# Altium project radxa_cm5_io_board_v2200_SCH-1.PrjPcb (part 4 of 5)

## Sheet 17_Connector.SchDoc
size 513 x 386 mm
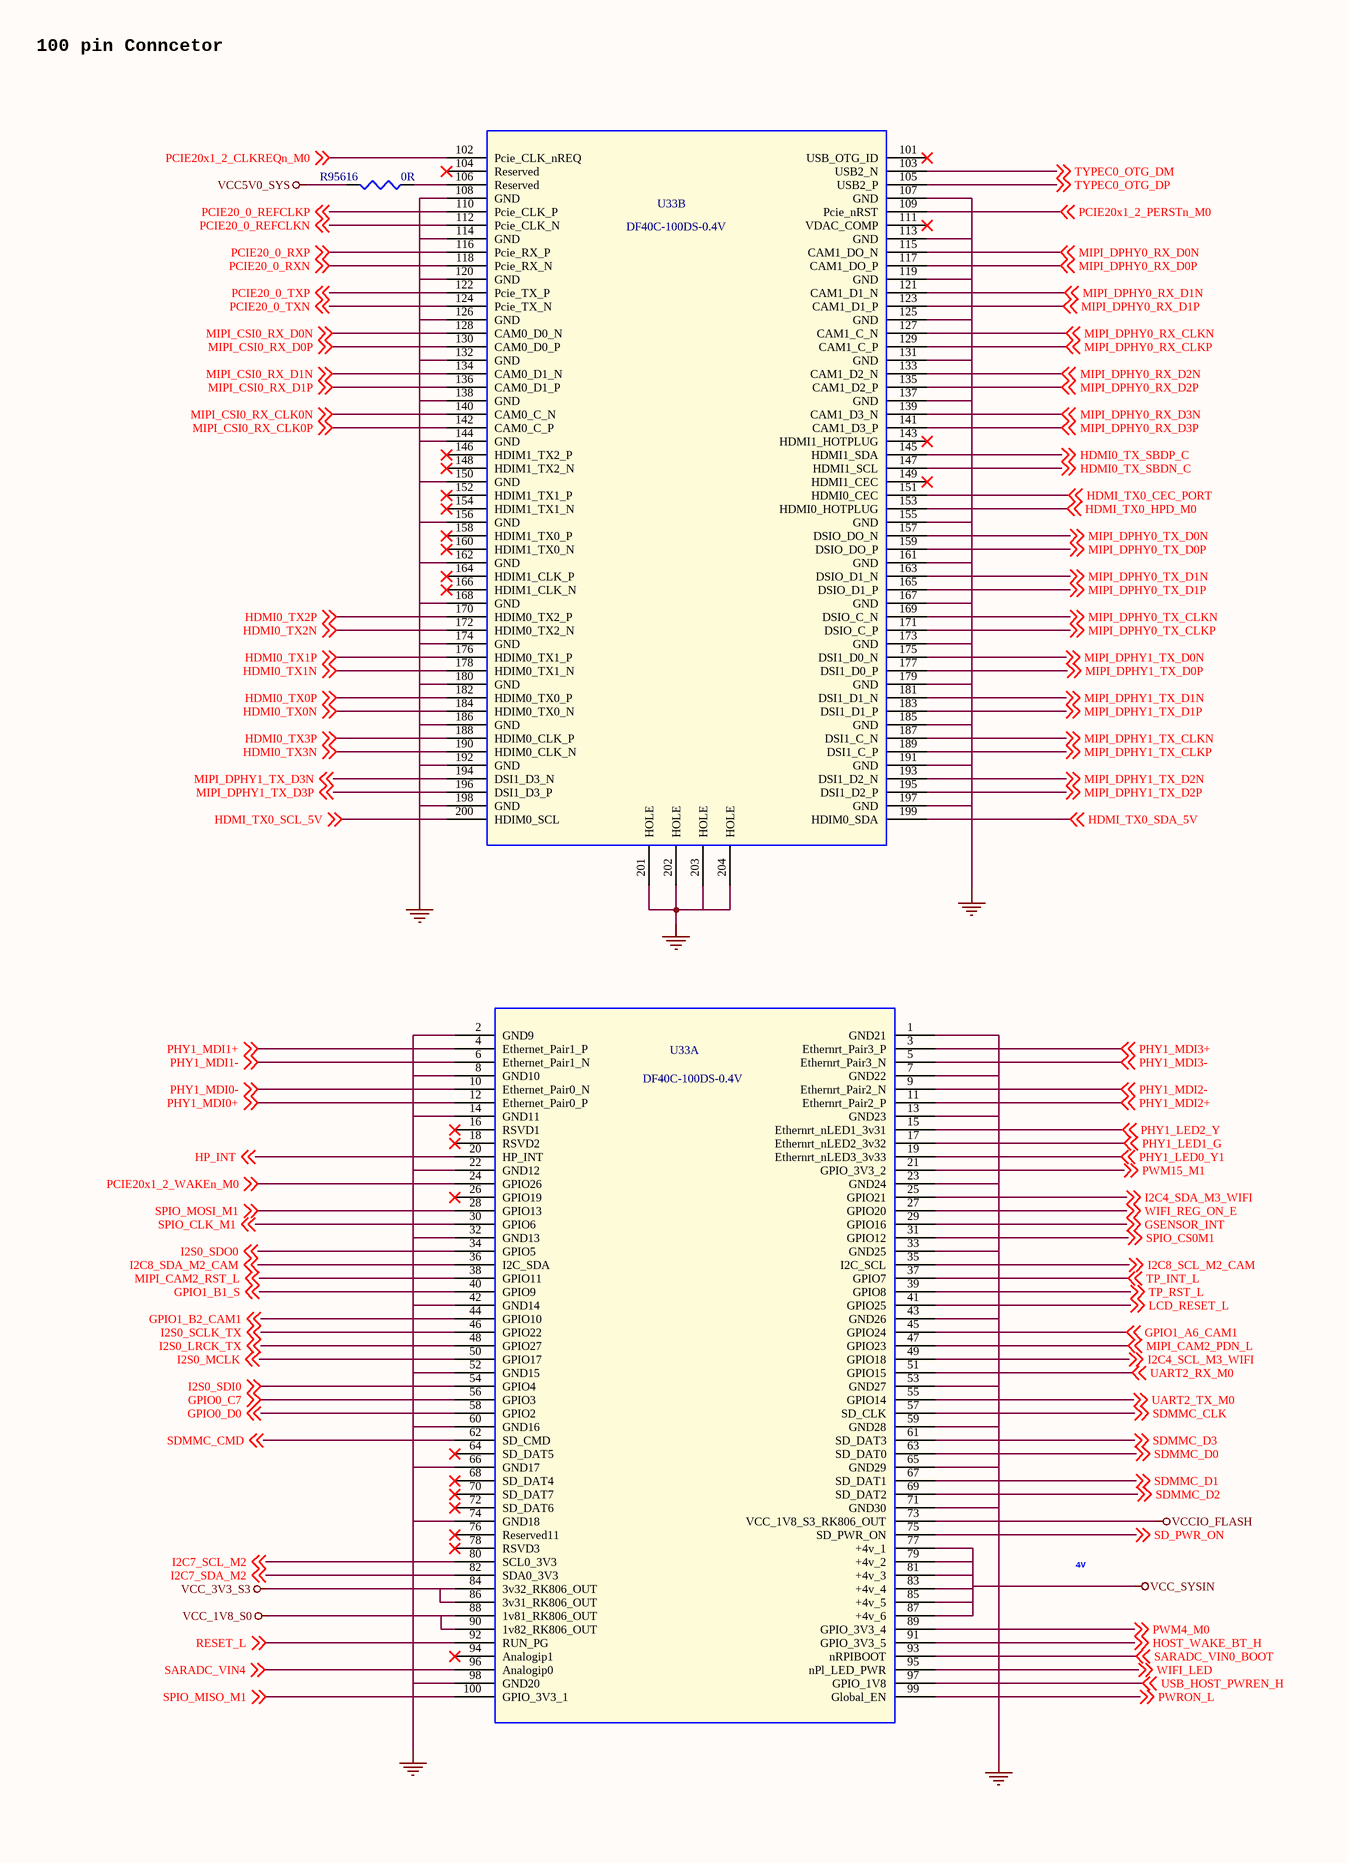
[diagram p16: 17_Connector.SchDoc, left]
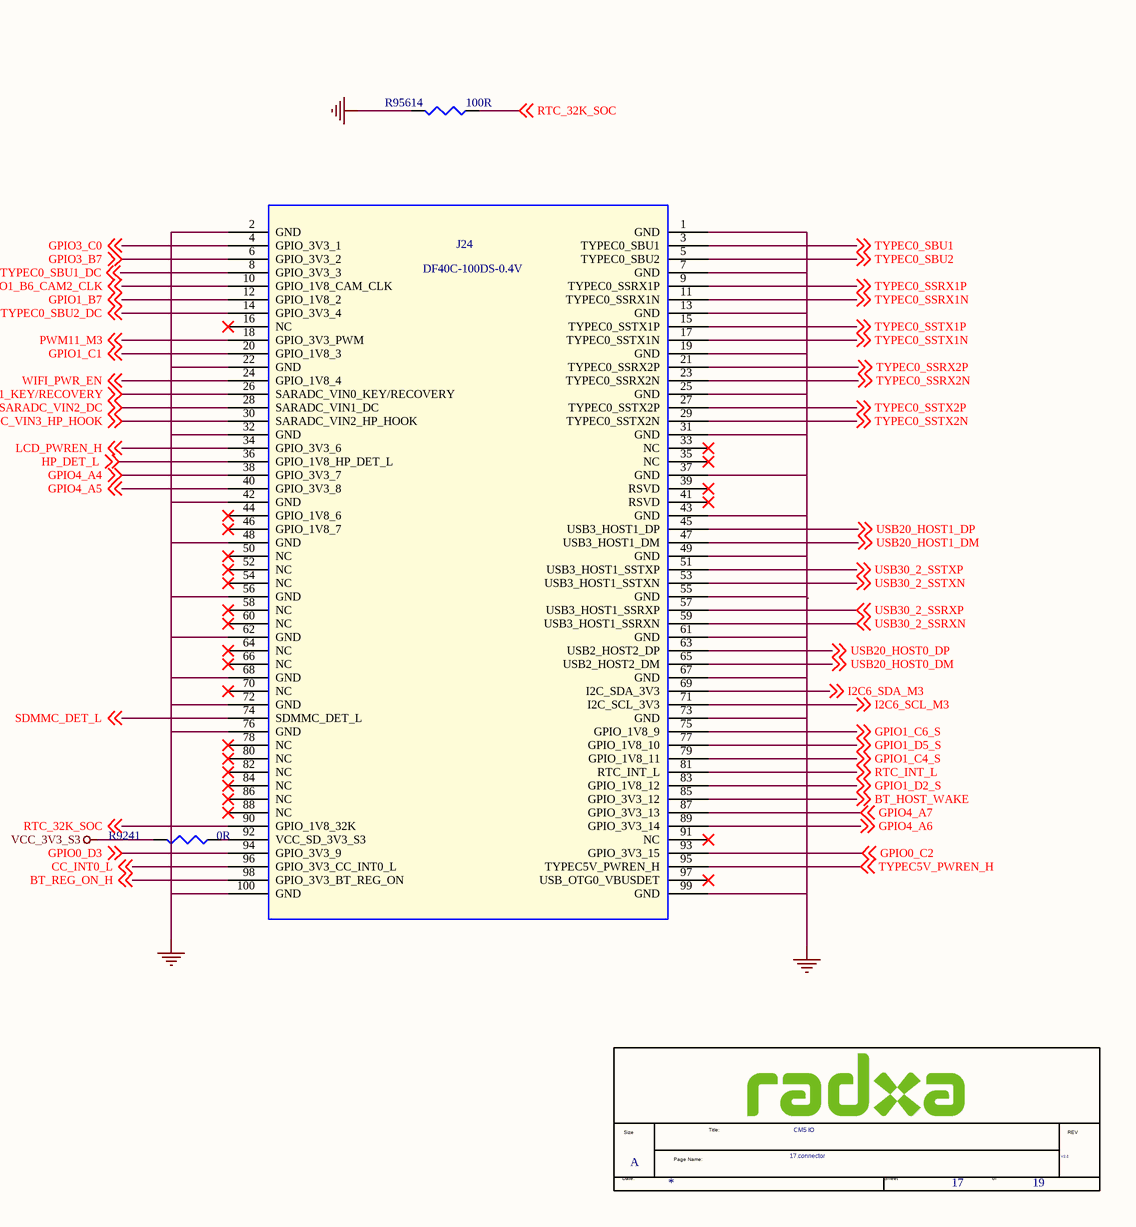
[diagram p17: 17_Connector.SchDoc, right]

### Parts
(Parts that share a designator on the sheet are numbered #1, #2 ... from top to bottom, then left to right.)
*#17  Doc: 17.connector  RevCode: V2.2  Title: CM5 IO  Page Size: A  Page Number: 17  Page Count: 19  (hidden comment: radxa_1010)  (graphical)
J24  DF40C-100DS-0.4V  [DF40C_100DS]
R9241  0R  [R0402]
R95614  100R  [R0402]
R95616  0R  [R0402]
U33#1  DF40C-100DS-0.4V  [DF40C-200DS-D4-OK]  (part B of 2)
U33#2  DF40C-100DS-0.4V  [DF40C-200DS-D4-OK]  (part A of 2)

### Nets
GND: J24.1(GND) J24.2(GND) J24.7(GND) J24.13(GND) J24.19(GND) J24.22(GND) J24.25(GND) J24.31(GND) J24.32(GND) J24.37(GND) J24.42(GND) J24.43(GND) J24.48(GND) J24.49(GND) J24.55(GND) J24.56(GND) J24.61(GND) J24.62(GND) J24.67(GND) J24.68(GND) J24.72(GND) J24.73(GND) J24.76(GND) J24.99(GND) J24.100(GND) R95614.2 U33#1.107(GND) U33#1.108(GND) U33#1.113(GND) U33#1.114(GND) U33#1.119(GND) U33#1.120(GND) U33#1.125(GND) U33#1.126(GND) U33#1.131(GND) U33#1.132(GND) U33#1.137(GND) U33#1.138(GND) U33#1.144(GND) U33#1.150(GND) U33#1.155(GND) U33#1.156(GND) U33#1.161(GND) U33#1.162(GND) U33#1.167(GND) U33#1.168(GND) U33#1.173(GND) U33#1.174(GND) U33#1.179(GND) U33#1.180(GND) U33#1.185(GND) U33#1.186(GND) U33#1.191(GND) U33#1.192(GND) U33#1.197(GND) U33#1.198(GND) U33#1.201(HOLE) U33#1.202(HOLE) U33#1.203(HOLE) U33#1.204(HOLE) U33#2.1(GND21) U33#2.2(GND9) U33#2.7(GND22) U33#2.8(GND10) U33#2.13(GND23) U33#2.14(GND11) U33#2.22(GND12) U33#2.23(GND24) U33#2.32(GND13) U33#2.33(GND25) U33#2.42(GND14) U33#2.43(GND26) U33#2.52(GND15) U33#2.53(GND27) U33#2.59(GND28) U33#2.60(GND16) U33#2.65(GND29) U33#2.66(GND17) U33#2.71(GND30) U33#2.74(GND18) U33#2.98(GND20)
VCC5V0_SYS: R95616.2
VCC_1V8_S0: U33#2.88(1v81_RK806_OUT) U33#2.90(1v82_RK806_OUT)
VCC_3V3_S3: R9241.1 U33#2.84(3v32_RK806_OUT) U33#2.86(3v31_RK806_OUT)
VCC_SYSIN: U33#2.77(+4v_1) U33#2.79(+4v_2) U33#2.81(+4v_3) U33#2.83(+4v_4) U33#2.85(+4v_5) U33#2.87(+4v_6)
VCCIO_FLASH: U33#2.73(VCC_1V8_S3_RK806_OUT)
BT_HOST_WAKE: J24.85(GPIO_3V3_12) ; off-sheet BT_HOST_WAKE
BT_REG_ON_H: J24.98(GPIO_3V3_BT_REG_ON) ; off-sheet BT_REG_ON_H
CC_INT0_L: J24.96(GPIO_3V3_CC_INT0_L) ; off-sheet CC_INT0_L
GPIO0_C2: J24.93(GPIO_3V3_15) ; off-sheet GPIO0_C2
GPIO0_C7: U33#2.56(GPIO3) ; off-sheet GPIO0_C7
GPIO0_D0: U33#2.58(GPIO2) ; off-sheet GPIO0_D0
GPIO0_D3: J24.94(GPIO_3V3_9) ; off-sheet GPIO0_D3
GPIO1_A6_CAM1: U33#2.45(GPIO24) ; off-sheet GPIO1_A6_CAM1
GPIO1_B1_S: U33#2.40(GPIO9) ; off-sheet GPIO1_B1_S
GPIO1_B2_CAM1: U33#2.44(GPIO10) ; off-sheet GPIO1_B2_CAM1
GPIO1_B6_CAM2_CLK: J24.10(GPIO_1V8_CAM_CLK) ; off-sheet GPIO1_B6_CAM2_CLK
GPIO1_B7: J24.12(GPIO_1V8_2) ; off-sheet GPIO1_B7
GPIO1_C1: J24.20(GPIO_1V8_3) ; off-sheet GPIO1_C1
GPIO1_C4_S: J24.79(GPIO_1V8_11) ; off-sheet GPIO1_C4_S
GPIO1_C6_S: J24.75(GPIO_1V8_9) ; off-sheet GPIO1_C6_S
GPIO1_D2_S: J24.83(GPIO_1V8_12) ; off-sheet GPIO1_D2_S
GPIO1_D5_S: J24.77(GPIO_1V8_10) ; off-sheet GPIO1_D5_S
GPIO3_B7: J24.6(GPIO_3V3_2) ; off-sheet GPIO3_B7
GPIO3_C0: J24.4(GPIO_3V3_1) ; off-sheet GPIO3_C0
GPIO4_A4: J24.38(GPIO_3V3_7) ; off-sheet GPIO4_A4
GPIO4_A5: J24.40(GPIO_3V3_8) ; off-sheet GPIO4_A5
GPIO4_A6: J24.89(GPIO_3V3_14) ; off-sheet GPIO4_A6
GPIO4_A7: J24.87(GPIO_3V3_13) ; off-sheet GPIO4_A7
GSENSOR_INT: U33#2.29(GPIO16) ; off-sheet GSENSOR_INT
HDMI0_TX0N: U33#1.184(HDIM0_TX0_N) ; off-sheet HDMI0_TX0N
HDMI0_TX0P: U33#1.182(HDIM0_TX0_P) ; off-sheet HDMI0_TX0P
HDMI0_TX1N: U33#1.178(HDIM0_TX1_N) ; off-sheet HDMI0_TX1N
HDMI0_TX1P: U33#1.176(HDIM0_TX1_P) ; off-sheet HDMI0_TX1P
HDMI0_TX2N: U33#1.172(HDIM0_TX2_N) ; off-sheet HDMI0_TX2N
HDMI0_TX2P: U33#1.170(HDIM0_TX2_P) ; off-sheet HDMI0_TX2P
HDMI0_TX3N: U33#1.190(HDIM0_CLK_N) ; off-sheet HDMI0_TX3N
HDMI0_TX3P: U33#1.188(HDIM0_CLK_P) ; off-sheet HDMI0_TX3P
HDMI0_TX_SBDN_C: U33#1.147(HDMI1_SCL) ; off-sheet HDMI0_TX_SBDN_C
HDMI0_TX_SBDP_C: U33#1.145(HDMI1_SDA) ; off-sheet HDMI0_TX_SBDP_C
HDMI_TX0_CEC_PORT: U33#1.151(HDMI0_CEC) ; off-sheet HDMI_TX0_CEC_PORT
HDMI_TX0_HPD_M0: U33#1.153(HDMI0_HOTPLUG) ; off-sheet HDMI_TX0_HPD_M0
HDMI_TX0_SCL_5V: U33#1.200(HDIM0_SCL) ; off-sheet HDMI_TX0_SCL_5V
HDMI_TX0_SDA_5V: U33#1.199(HDIM0_SDA) ; off-sheet HDMI_TX0_SDA_5V
HOST_WAKE_BT_H: U33#2.91(GPIO_3V3_5) ; off-sheet HOST_WAKE_BT_H
HP_DET_L: J24.36(GPIO_1V8_HP_DET_L) ; off-sheet HP_DET_L
HP_INT: U33#2.20(HP_INT) ; off-sheet HP_INT
I2C4_SCL_M3_WIFI: U33#2.49(GPIO18) ; off-sheet I2C4_SCL_M3_WIFI
I2C4_SDA_M3_WIFI: U33#2.25(GPIO21) ; off-sheet I2C4_SDA_M3_WIFI
I2C6_SCL_M3: J24.71(I2C_SCL_3V3) ; off-sheet I2C6_SCL_M3
I2C6_SDA_M3: J24.69(I2C_SDA_3V3) ; off-sheet I2C6_SDA_M3
I2C7_SCL_M2: U33#2.80(SCL0_3V3) ; off-sheet I2C7_SCL_M2
I2C7_SDA_M2: U33#2.82(SDA0_3V3) ; off-sheet I2C7_SDA_M2
I2C8_SCL_M2_CAM: U33#2.35(I2C_SCL) ; off-sheet I2C8_SCL_M2_CAM
I2C8_SDA_M2_CAM: U33#2.36(I2C_SDA) ; off-sheet I2C8_SDA_M2_CAM
I2S0_LRCK_TX: U33#2.48(GPIO27) ; off-sheet I2S0_LRCK_TX
I2S0_MCLK: U33#2.50(GPIO17) ; off-sheet I2S0_MCLK
I2S0_SCLK_TX: U33#2.46(GPIO22) ; off-sheet I2S0_SCLK_TX
I2S0_SDI0: U33#2.54(GPIO4) ; off-sheet I2S0_SDI0
I2S0_SDO0: U33#2.34(GPIO5) ; off-sheet I2S0_SDO0
LCD_PWREN_H: J24.34(GPIO_3V3_6) ; off-sheet LCD_PWREN_H
LCD_RESET_L: U33#2.41(GPIO25) ; off-sheet LCD_RESET_L
MIPI_CAM2_PDN_L: U33#2.47(GPIO23) ; off-sheet MIPI_CAM2_PDN_L
MIPI_CAM2_RST_L: U33#2.38(GPIO11) ; off-sheet MIPI_CAM2_RST_L
MIPI_CSI0_RX_CLK0N: U33#1.140(CAM0_C_N) ; off-sheet MIPI_CSI0_RX_CLK0N
MIPI_CSI0_RX_CLK0P: U33#1.142(CAM0_C_P) ; off-sheet MIPI_CSI0_RX_CLK0P
MIPI_CSI0_RX_D0N: U33#1.128(CAM0_D0_N) ; off-sheet MIPI_CSI0_RX_D0N
MIPI_CSI0_RX_D0P: U33#1.130(CAM0_D0_P) ; off-sheet MIPI_CSI0_RX_D0P
MIPI_CSI0_RX_D1N: U33#1.134(CAM0_D1_N) ; off-sheet MIPI_CSI0_RX_D1N
MIPI_CSI0_RX_D1P: U33#1.136(CAM0_D1_P) ; off-sheet MIPI_CSI0_RX_D1P
MIPI_DPHY0_RX_CLKN: U33#1.127(CAM1_C_N) ; off-sheet MIPI_DPHY0_RX_CLKN
MIPI_DPHY0_RX_CLKP: U33#1.129(CAM1_C_P) ; off-sheet MIPI_DPHY0_RX_CLKP
MIPI_DPHY0_RX_D0N: U33#1.115(CAM1_DO_N) ; off-sheet MIPI_DPHY0_RX_D0N
MIPI_DPHY0_RX_D0P: U33#1.117(CAM1_DO_P) ; off-sheet MIPI_DPHY0_RX_D0P
MIPI_DPHY0_RX_D1N: U33#1.121(CAM1_D1_N) ; off-sheet MIPI_DPHY0_RX_D1N
MIPI_DPHY0_RX_D1P: U33#1.123(CAM1_D1_P) ; off-sheet MIPI_DPHY0_RX_D1P
MIPI_DPHY0_RX_D2N: U33#1.133(CAM1_D2_N) ; off-sheet MIPI_DPHY0_RX_D2N
MIPI_DPHY0_RX_D2P: U33#1.135(CAM1_D2_P) ; off-sheet MIPI_DPHY0_RX_D2P
MIPI_DPHY0_RX_D3N: U33#1.139(CAM1_D3_N) ; off-sheet MIPI_DPHY0_RX_D3N
MIPI_DPHY0_RX_D3P: U33#1.141(CAM1_D3_P) ; off-sheet MIPI_DPHY0_RX_D3P
MIPI_DPHY0_TX_CLKN: U33#1.169(DSIO_C_N) ; off-sheet MIPI_DPHY0_TX_CLKN
MIPI_DPHY0_TX_CLKP: U33#1.171(DSIO_C_P) ; off-sheet MIPI_DPHY0_TX_CLKP
MIPI_DPHY0_TX_D0N: U33#1.157(DSIO_DO_N) ; off-sheet MIPI_DPHY0_TX_D0N
MIPI_DPHY0_TX_D0P: U33#1.159(DSIO_DO_P) ; off-sheet MIPI_DPHY0_TX_D0P
MIPI_DPHY0_TX_D1N: U33#1.163(DSIO_D1_N) ; off-sheet MIPI_DPHY0_TX_D1N
MIPI_DPHY0_TX_D1P: U33#1.165(DSIO_D1_P) ; off-sheet MIPI_DPHY0_TX_D1P
MIPI_DPHY1_TX_CLKN: U33#1.187(DSI1_C_N) ; off-sheet MIPI_DPHY1_TX_CLKN
MIPI_DPHY1_TX_CLKP: U33#1.189(DSI1_C_P) ; off-sheet MIPI_DPHY1_TX_CLKP
MIPI_DPHY1_TX_D0N: U33#1.175(DSI1_D0_N) ; off-sheet MIPI_DPHY1_TX_D0N
MIPI_DPHY1_TX_D0P: U33#1.177(DSI1_D0_P) ; off-sheet MIPI_DPHY1_TX_D0P
MIPI_DPHY1_TX_D1N: U33#1.181(DSI1_D1_N) ; off-sheet MIPI_DPHY1_TX_D1N
MIPI_DPHY1_TX_D1P: U33#1.183(DSI1_D1_P) ; off-sheet MIPI_DPHY1_TX_D1P
MIPI_DPHY1_TX_D2N: U33#1.193(DSI1_D2_N) ; off-sheet MIPI_DPHY1_TX_D2N
MIPI_DPHY1_TX_D2P: U33#1.195(DSI1_D2_P) ; off-sheet MIPI_DPHY1_TX_D2P
MIPI_DPHY1_TX_D3N: U33#1.194(DSI1_D3_N) ; off-sheet MIPI_DPHY1_TX_D3N
MIPI_DPHY1_TX_D3P: U33#1.196(DSI1_D3_P) ; off-sheet MIPI_DPHY1_TX_D3P
PCIE20_0_REFCLKN: U33#1.112(Pcie_CLK_N) ; off-sheet PCIE20_0_REFCLKN
PCIE20_0_REFCLKP: U33#1.110(Pcie_CLK_P) ; off-sheet PCIE20_0_REFCLKP
PCIE20_0_RXN: U33#1.118(Pcie_RX_N) ; off-sheet PCIE20_0_RXN
PCIE20_0_RXP: U33#1.116(Pcie_RX_P) ; off-sheet PCIE20_0_RXP
PCIE20_0_TXN: U33#1.124(Pcie_TX_N) ; off-sheet PCIE20_0_TXN
PCIE20_0_TXP: U33#1.122(Pcie_TX_P) ; off-sheet PCIE20_0_TXP
PCIE20x1_2_CLKREQn_M0: U33#1.102(Pcie_CLK_nREQ) ; off-sheet PCIE20x1_2_CLKREQn_M0
PCIE20x1_2_PERSTn_M0: U33#1.109(Pcie_nRST) ; off-sheet PCIE20x1_2_PERSTn_M0
PCIE20x1_2_WAKEn_M0: U33#2.24(GPIO26) ; off-sheet PCIE20x1_2_WAKEn_M0
PHY1_LED0_Y1: U33#2.19(Ethernrt_nLED3_3v33) ; off-sheet PHY1_LED0_Y1
PHY1_LED1_G: U33#2.17(Ethernrt_nLED2_3v32) ; off-sheet PHY1_LED1_G
PHY1_LED2_Y: U33#2.15(Ethernrt_nLED1_3v31) ; off-sheet PHY1_LED2_Y
PHY1_MDI0+: U33#2.12(Ethernet_Pair0_P) ; off-sheet PHY1_MDI0+
PHY1_MDI0-: U33#2.10(Ethernet_Pair0_N) ; off-sheet PHY1_MDI0-
PHY1_MDI1+: U33#2.4(Ethernet_Pair1_P) ; off-sheet PHY1_MDI1+
PHY1_MDI1-: U33#2.6(Ethernet_Pair1_N) ; off-sheet PHY1_MDI1-
PHY1_MDI2+: U33#2.11(Ethernrt_Pair2_P) ; off-sheet PHY1_MDI2+
PHY1_MDI2-: U33#2.9(Ethernrt_Pair2_N) ; off-sheet PHY1_MDI2-
PHY1_MDI3+: U33#2.3(Ethernrt_Pair3_P) ; off-sheet PHY1_MDI3+
PHY1_MDI3-: U33#2.5(Ethernrt_Pair3_N) ; off-sheet PHY1_MDI3-
PWM4_M0: U33#2.89(GPIO_3V3_4) ; off-sheet PWM4_M0
PWM11_M3: J24.18(GPIO_3V3_PWM) ; off-sheet PWM11_M3
PWM15_M1: U33#2.21(GPIO_3V3_2) ; off-sheet PWM15_M1
PWRON_L: U33#2.99(Global_EN) ; off-sheet PWRON_L
RESET_L: U33#2.92(RUN_PG) ; off-sheet RESET_L
RTC_32K_SOC: J24.90(GPIO_1V8_32K) R95614.1 ; off-sheet RTC_32K_SOC
RTC_INT_L: J24.81(RTC_INT_L) ; off-sheet RTC_INT_L
SARADC_VIN0_BOOT: U33#2.93(nRPIBOOT) ; off-sheet SARADC_VIN0_BOOT
SARADC_VIN1_KEY/RECOVERY: J24.26(SARADC_VIN0_KEY/RECOVERY) ; off-sheet SARADC_VIN1_KEY/RECOVERY
SARADC_VIN2_DC: J24.28(SARADC_VIN1_DC) ; off-sheet SARADC_VIN2_DC
SARADC_VIN3_HP_HOOK: J24.30(SARADC_VIN2_HP_HOOK) ; off-sheet SARADC_VIN3_HP_HOOK
SARADC_VIN4: U33#2.96(Analogip0) ; off-sheet SARADC_VIN4
SD_PWR_ON: U33#2.75(SD_PWR_ON) ; off-sheet SD_PWR_ON
SDMMC_CLK: U33#2.57(SD_CLK) ; off-sheet SDMMC_CLK
SDMMC_CMD: U33#2.62(SD_CMD) ; off-sheet SDMMC_CMD
SDMMC_D0: U33#2.63(SD_DAT0) ; off-sheet SDMMC_D0
SDMMC_D1: U33#2.67(SD_DAT1) ; off-sheet SDMMC_D1
SDMMC_D2: U33#2.69(SD_DAT2) ; off-sheet SDMMC_D2
SDMMC_D3: U33#2.61(SD_DAT3) ; off-sheet SDMMC_D3
SDMMC_DET_L: J24.74(SDMMC_DET_L) ; off-sheet SDMMC_DET_L
SPIO_CLK_M1: U33#2.30(GPIO6) ; off-sheet SPIO_CLK_M1
SPIO_CS0M1: U33#2.31(GPIO12) ; off-sheet SPIO_CS0M1
SPIO_MISO_M1: U33#2.100(GPIO_3V3_1) ; off-sheet SPIO_MISO_M1
SPIO_MOSI_M1: U33#2.28(GPIO13) ; off-sheet SPIO_MOSI_M1
TP_INT_L: U33#2.37(GPIO7) ; off-sheet TP_INT_L
TP_RST_L: U33#2.39(GPIO8) ; off-sheet TP_RST_L
TYPEC0_OTG_DM: U33#1.103(USB2_N) ; off-sheet TYPEC0_OTG_DM
TYPEC0_OTG_DP: U33#1.105(USB2_P) ; off-sheet TYPEC0_OTG_DP
TYPEC0_SBU1: J24.3(TYPEC0_SBU1) ; off-sheet TYPEC0_SBU1
TYPEC0_SBU1_DC: J24.8(GPIO_3V3_3) ; off-sheet TYPEC0_SBU1_DC
TYPEC0_SBU2: J24.5(TYPEC0_SBU2) ; off-sheet TYPEC0_SBU2
TYPEC0_SBU2_DC: J24.14(GPIO_3V3_4) ; off-sheet TYPEC0_SBU2_DC
TYPEC0_SSRX1N: J24.11(TYPEC0_SSRX1N) ; off-sheet TYPEC0_SSRX1N
TYPEC0_SSRX1P: J24.9(TYPEC0_SSRX1P) ; off-sheet TYPEC0_SSRX1P
TYPEC0_SSRX2N: J24.23(TYPEC0_SSRX2N) ; off-sheet TYPEC0_SSRX2N
TYPEC0_SSRX2P: J24.21(TYPEC0_SSRX2P) ; off-sheet TYPEC0_SSRX2P
TYPEC0_SSTX1N: J24.17(TYPEC0_SSTX1N) ; off-sheet TYPEC0_SSTX1N
TYPEC0_SSTX1P: J24.15(TYPEC0_SSTX1P) ; off-sheet TYPEC0_SSTX1P
TYPEC0_SSTX2N: J24.29(TYPEC0_SSTX2N) ; off-sheet TYPEC0_SSTX2N
TYPEC0_SSTX2P: J24.27(TYPEC0_SSTX2P) ; off-sheet TYPEC0_SSTX2P
TYPEC5V_PWREN_H: J24.95(TYPEC5V_PWREN_H) ; off-sheet TYPEC5V_PWREN_H
UART2_RX_M0: U33#2.51(GPIO15) ; off-sheet UART2_RX_M0
UART2_TX_M0: U33#2.55(GPIO14) ; off-sheet UART2_TX_M0
USB20_HOST0_DM: J24.65(USB2_HOST2_DM) ; off-sheet USB20_HOST0_DM
USB20_HOST0_DP: J24.63(USB2_HOST2_DP) ; off-sheet USB20_HOST0_DP
USB20_HOST1_DM: J24.47(USB3_HOST1_DM) ; off-sheet USB20_HOST1_DM
USB20_HOST1_DP: J24.45(USB3_HOST1_DP) ; off-sheet USB20_HOST1_DP
USB30_2_SSRXN: J24.59(USB3_HOST1_SSRXN) ; off-sheet USB30_2_SSRXN
USB30_2_SSRXP: J24.57(USB3_HOST1_SSRXP) ; off-sheet USB30_2_SSRXP
USB30_2_SSTXN: J24.53(USB3_HOST1_SSTXN) ; off-sheet USB30_2_SSTXN
USB30_2_SSTXP: J24.51(USB3_HOST1_SSTXP) ; off-sheet USB30_2_SSTXP
USB_HOST_PWREN_H: U33#2.97(GPIO_1V8) ; off-sheet USB_HOST_PWREN_H
WIFI_LED: U33#2.95(nPl_LED_PWR) ; off-sheet WIFI_LED
WIFI_PWR_EN: J24.24(GPIO_1V8_4) ; off-sheet WIFI_PWR_EN
WIFI_REG_ON_E: U33#2.27(GPIO20) ; off-sheet WIFI_REG_ON_E
NetJ24_92: J24.92(VCC_SD_3V3_S3) R9241.2
NetR95616_1: R95616.1 U33#1.106(Reserved)

Not connected (* = marked no-connect by the designer): J24 16(NC)* 33(NC)* 35(NC)* 39(RSVD)* 41(RSVD)* 44(GPIO_1V8_6)* 46(GPIO_1V8_7)* 50(NC)* 52(NC)* 54(NC)* 58(NC)* 60(NC)* 64(NC)* 66(NC)* 70(NC)* 78(NC)* 80(NC)* 82(NC)* 84(NC)* 86(NC)* 88(NC)* 91(NC)* 97(USB_OTG0_VBUSDET)*; U33#1 101(USB_OTG_ID)* 104(Reserved)* 111(VDAC_COMP)* 143(HDMI1_HOTPLUG)* 146(HDIM1_TX2_P)* 148(HDIM1_TX2_N)* 149(HDMI1_CEC)* 152(HDIM1_TX1_P)* 154(HDIM1_TX1_N)* 158(HDIM1_TX0_P)* 160(HDIM1_TX0_N)* 164(HDIM1_CLK_P)* 166(HDIM1_CLK_N)*; U33#2 16(RSVD1)* 18(RSVD2)* 26(GPIO19)* 64(SD_DAT5)* 68(SD_DAT4)* 70(SD_DAT7)* 72(SD_DAT6)* 76(Reserved11)* 78(RSVD3)* 94(Analogip1)*

### Notes on the sheet
- 100 pin Conncetor
- 4V
- (in symbol radxa_1010) Size; Title:; REV; Page Name:; Date:; Sheet; of

### Library data of the parts
J24 = CN_0: PCB Footprint: DF40C_100DS
R9241 = RESISTOR_3: 通用厚膜电阻,330R,+/-5%,R0402,1/16W.; Manufacturer: YAGEO; Tolerance: 5%; PCB Footprint: R0201; RK PN: RC0402JR-07330RL; Priority: A; Wattage: 1/16W; Part Type: 通用厚膜电阻; Manufacturer PN: RC0402JR-07330RL; Created by: YTL
R95614 R95616 = RESISTOR_0_Dup4: 通用厚膜电阻,2K49,+/-1%,R0402,1/16W.; Manufacturer: YAGEO; Tolerance: 1%; RK PN: RC0402FR-072K49L; Priority: A; Wattage: 1/16W; PCB Footprint: R0402; Part Type: 通用厚膜电阻; Manufacturer PN: RC0402FR-072K49L; Created by: YTL
U33#1 = HETER_4: PCB Footprint: DF40C-200DS-D4-OK
U33#2 = HETER_0: PCB Footprint: DF40C-200DS-D4-OK
*#17 = radxa_1010: Page Create Date: March  8, 1995; Page Modify Date: *

## Sheet 18_Type_C.SchDoc
size 420 x 297 mm
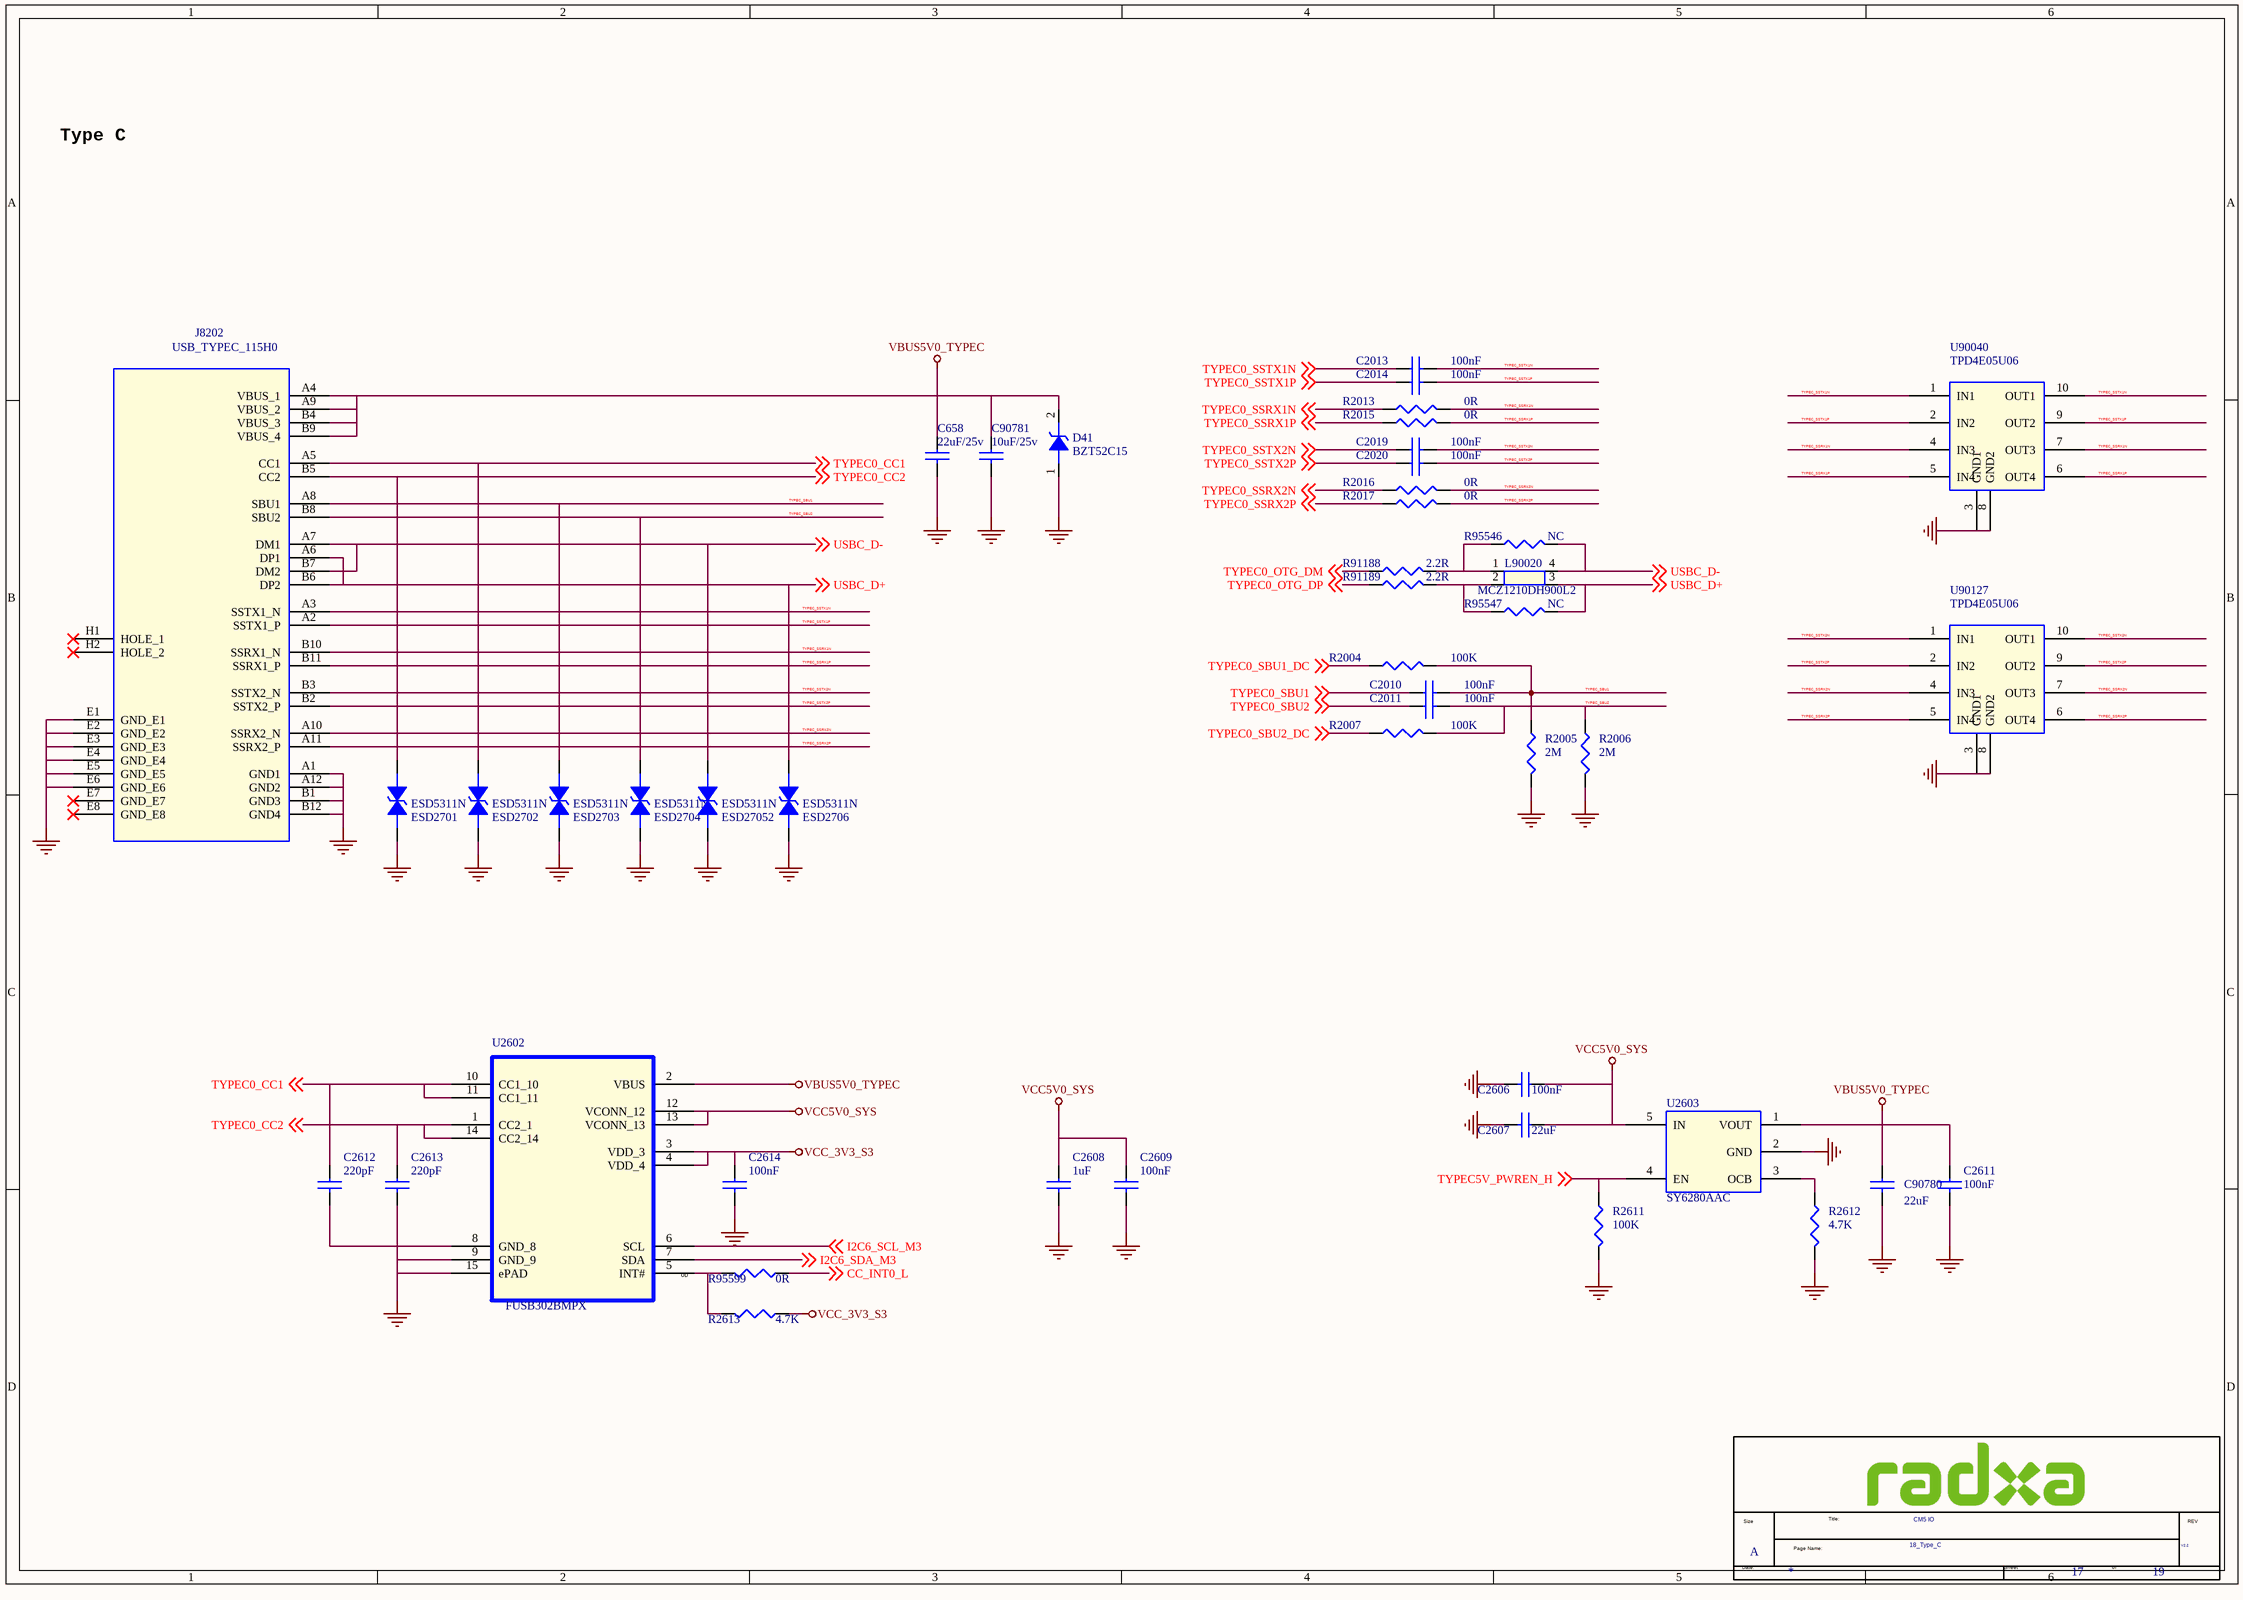
[diagram p18: 18_Type_C.SchDoc]

### Parts
(Parts that share a designator on the sheet are numbered #1, #2 ... from top to bottom, then left to right.)
*#18  Doc: 18_Type_C  RevCode: V2.2  Title: CM5 IO  Page Size: A  Page Number: 17  Page Count: 19  (hidden comment: radxa_1010)  (graphical)
C658  22uF/25v  [C0201]
C2010  100nF  [C0201]
C2011  100nF  [C0201]
C2013  100nF  [C0201]
C2014  100nF  [C0201]
C2019  100nF  [C0201]
C2020  100nF  [C0201]
C2606  100nF  [C0402]
C2607  22uF  [C0603]
C2608  1uF  [C0402]
C2609  100nF  [C0402]
C2611  100nF  [C0402]
C2612  220pF  [C0402]
C2613  220pF  [C0402]
C2614  100nF  [C0402]
C90780  22uF  [C0805]
C90781  10uF/25v  [C0201]
D41  BZT52C15  [SOD_123]
ESD2701  ESD5311N  [ESD0402]
ESD2702  ESD5311N  [ESD0402]
ESD2703  ESD5311N  [ESD0402]
ESD2704  ESD5311N  [ESD0402]
ESD2706  ESD5311N  [ESD0402]
ESD27052  ESD5311N  [ESD0402]
J8202  USB_TYPEC_115H0  [TYPEC-24PIN-SMD-OK]
L90020  MCZ1210DH900L2  [MCZ1210AH900L2]
R2004  100K  [R0402]
R2005  2M  [R0402]
R2006  2M  [R0402]
R2007  100K  [R0402]
R2013  0R  [R0402]
R2015  0R  [R0402]
R2016  0R  [R0402]
R2017  0R  [R0402]
R2611  100K  [R0402]
R2612  4.7K  [R0402]
R2613  4.7K  [R0402]
R91188  2.2R  [R0402]
R91189  2.2R  [R0402]
R95546  NC  [R0402]
R95547  NC  [R0402]
R95599  0R  [R0402]
U2602  FUSB302BMPX  [MLP14_2R50X2R50X0R80]
U2603  SY6280AAC  [SOT_23_5]
U90040  TPD4E05U06  [SON10_2R50X1R00X0R50]
U90127  TPD4E05U06  [SON10_2R50X1R00X0R50]

### Nets
GND: C658.2 C2606.2 C2607.2 C2608.2 C2609.2 C2611.2 C2612.2 C2613.2 C2614.2 C90780.2 C90781.2 D41.1(ANODE) ESD2701.2 ESD2702.2 ESD2703.2 ESD2704.2 ESD2706.2 ESD27052.2 J8202.A1(GND1) J8202.A12(GND2) J8202.B1(GND3) J8202.B12(GND4) J8202.E1(GND_E1) J8202.E2(GND_E2) J8202.E3(GND_E3) J8202.E4(GND_E4) J8202.E5(GND_E5) J8202.E6(GND_E6) R2005.2 R2006.2 R2611.2 R2612.2 U2602.8(GND_8) U2602.9(GND_9) U2602.15(ePAD) U2603.2(GND) U90040.3(GND1) U90040.8(GND2) U90127.3(GND1) U90127.8(GND2)
VBUS5V0_TYPEC: C658.1 C2611.1 C90780.1 C90781.1 D41.2(CATHODE) J8202.A4(VBUS_1) J8202.A9(VBUS_2) J8202.B4(VBUS_3) J8202.B9(VBUS_4) U2602.2(VBUS) U2603.1(VOUT)
VCC5V0_SYS: C2606.1 C2607.1 C2608.1 C2609.1 U2602.12(VCONN_12) U2602.13(VCONN_13) U2603.5(IN)
VCC_3V3_S3: C2614.1 R2613.1 U2602.3(VDD_3) U2602.4(VDD_4)
CC_INT0_L: R95599.1 ; off-sheet CC_INT0_L
I2C6_SCL_M3: U2602.6(SCL) ; off-sheet I2C6_SCL_M3
I2C6_SDA_M3: U2602.7(SDA) ; off-sheet I2C6_SDA_M3
TYPEC0_CC1: C2612.1 ESD2702.1 J8202.A5(CC1) U2602.10(CC1_10) U2602.11(CC1_11) ; off-sheet TYPEC0_CC1
TYPEC0_CC2: C2613.1 ESD2701.1 J8202.B5(CC2) U2602.1(CC2_1) U2602.14(CC2_14) ; off-sheet TYPEC0_CC2
TYPEC0_OTG_DM: R91188.1 ; off-sheet TYPEC0_OTG_DM
TYPEC0_OTG_DP: R91189.1 ; off-sheet TYPEC0_OTG_DP
TYPEC0_SBU1: C2010.1 ; off-sheet TYPEC0_SBU1
TYPEC0_SBU1_DC: R2004.1 ; off-sheet TYPEC0_SBU1_DC
TYPEC0_SBU2: C2011.1 ; off-sheet TYPEC0_SBU2
TYPEC0_SBU2_DC: R2007.1 ; off-sheet TYPEC0_SBU2_DC
TYPEC0_SSRX1N: R2013.1 ; off-sheet TYPEC0_SSRX1N
TYPEC0_SSRX1P: R2015.1 ; off-sheet TYPEC0_SSRX1P
TYPEC0_SSRX2N: R2016.1 ; off-sheet TYPEC0_SSRX2N
TYPEC0_SSRX2P: R2017.1 ; off-sheet TYPEC0_SSRX2P
TYPEC0_SSTX1N: C2013.1 ; off-sheet TYPEC0_SSTX1N
TYPEC0_SSTX1P: C2014.1 ; off-sheet TYPEC0_SSTX1P
TYPEC0_SSTX2N: C2019.1 ; off-sheet TYPEC0_SSTX2N
TYPEC0_SSTX2P: C2020.1 ; off-sheet TYPEC0_SSTX2P
TYPEC5V_PWREN_H: R2611.1 U2603.4(EN) ; off-sheet TYPEC5V_PWREN_H
TYPEC_SBU1: C2010.2 ESD2703.1 J8202.A8(SBU1) R2004.2 R2005.1
TYPEC_SBU2: C2011.2 ESD2704.1 J8202.B8(SBU2) R2006.1 R2007.2
TYPEC_SSRX1N: J8202.B10(SSRX1_N) R2013.2 U90040.4(IN3) U90040.7(OUT3)
TYPEC_SSRX1P: J8202.B11(SSRX1_P) R2015.2 U90040.5(IN4) U90040.6(OUT4)
TYPEC_SSRX2N: J8202.A10(SSRX2_N) R2016.2 U90127.4(IN3) U90127.7(OUT3)
TYPEC_SSRX2P: J8202.A11(SSRX2_P) R2017.2 U90127.5(IN4) U90127.6(OUT4)
TYPEC_SSTX1N: C2013.2 J8202.A3(SSTX1_N) U90040.1(IN1) U90040.10(OUT1)
TYPEC_SSTX1P: C2014.2 J8202.A2(SSTX1_P) U90040.2(IN2) U90040.9(OUT2)
TYPEC_SSTX2N: C2019.2 J8202.B3(SSTX2_N) U90127.1(IN1) U90127.10(OUT1)
TYPEC_SSTX2P: C2020.2 J8202.B2(SSTX2_P) U90127.2(IN2) U90127.9(OUT2)
USBC_D+: ESD2706.1 J8202.A6(DP1) J8202.B6(DP2) L90020.3 R95547.2 ; off-sheet USBC_D+
USBC_D-: ESD27052.1 J8202.A7(DM1) J8202.B7(DM2) L90020.4 R95546.2 ; off-sheet USBC_D-
NetL90020_1: L90020.1 R91188.2 R95546.1
NetL90020_2: L90020.2 R91189.2 R95547.1
NetR2612_1: R2612.1 U2603.3(OCB)
NetR2613_2: R2613.2 R95599.2 U2602.5(INT#)

Not connected (* = marked no-connect by the designer): J8202 E7(GND_E7)* E8(GND_E8)* H1(HOLE_1)* H2(HOLE_2)*

### Notes on the sheet
- Type C
- (near U2602) OD
- (in symbol radxa_1010) Size; Title:; REV; Page Name:; Date:; Sheet; of

### Library data of the parts
C658 = C / 100 / nF / 0201_6: 0201 ∮ 10% 100nf X5R 6.3V; FS: Y; Property1: ∮ 10%; FPLIST: C0201,M0201; FunctionGroup: Petrus / BB; PCB Footprint: C0805; Property3: 6.3V; Property2: X5R
C2010 C2011 C2013 C2014 C2019 C2020 = CAP NP_0: cap,100.00nF,+/-10%,10V,X5R,C0201; Manufacturer: TDK; RK PN: C0603X5R1A104K030BC; Priority: A; Tolerance: 10%; Voltage: 10V; PCB Footprint: C0201; Dielectric: X5R; Part Type: C0201; Manufacturer PN: C0603X5R1A104K030BC; Created by: JJJ
C2606 = CAP NP_0: cap,100.00nF,+/-10%,16V,X5R,C0402; Manufacturer PN: C1005X5R1C104K050BA; Manufacturer: TDK; Tolerance: 10%; C_Voltage: 6.3V; Priority: A; Voltage: 16V; PCB Footprint: C0402; Dielectric: X5R; Created by: JJJ; Part Type: C0402; RK PN: C1005X5R1C104K050BA
C2607 = CAP NP_0: cap,22.00uF,+/-20%,10V,X5R,C0603; Manufacturer PN: C1608X5R1A226M080AC; Manufacturer: TDK; Tolerance: 20%; C_Voltage: 6.3V; Priority: A; Voltage: 10V; PCB Footprint: C0603; Dielectric: X5R; Created by: JJJ; Part Type: C0603; RK PN: C1608X5R1A226M080AC
C2608 = CAP NP_0: as C143 on sheet 15_Power_DCIN; Voltage: 16V; PCB Footprint: C0402; Dielectric: X5R; Part Type: C0402; Manufacturer PN: C1005X5R1C105K050BC; Created by: JJJ
C2609 = CAP NP_0: as C131 on sheet 15_Power_DCIN; Voltage: 16V; PCB Footprint: C0402; Dielectric: X5R; Created by: JJJ; Part Type: C0402; RK PN: C1005X5R1C104K050BA
C2611 = CAP NP_0: cap,100.00nF,+/-10%,16V,X5R,C0402; Manufacturer: TDK; Voltage: 25V; RK PN: C1005X5R1C104K050BA; Priority: A; Tolerance: 10%; PCB Footprint: C0402; Dielectric: X5R; Part Type: C0402; Manufacturer PN: C1005X5R1C104K050BA; Created by: JJJ
C2612 = CAP NP_0: cap,220.00pF,+/-5%,50V,C0G,C0402; Manufacturer PN: C1005C0G1H221J050BA; Manufacturer: TDK; Tolerance: 5%; Priority: A; Voltage: 50V; PCB Footprint: C0402; Dielectric: C0G; Created by: JJJ; Part Type: C0402; RK PN: C1005C0G1H221J050BA
C2613 = CAP NP_0: cap,220.00pF,+/-5%,50V,C0G,C0402; Manufacturer: TDK; RK PN: C1005C0G1H221J050BA; Priority: A; Tolerance: 5%; Voltage: 50V; PCB Footprint: C0402; Dielectric: C0G; Part Type: C0402; Manufacturer PN: C1005C0G1H221J050BA; Created by: JJJ
C2614 = CAP NP_0: as C141 on sheet 15_Power_DCIN; Voltage: 16V; PCB Footprint: C0402; Dielectric: X5R; Part Type: C0402; Manufacturer PN: C1005X5R1C104K050BA; Created by: JJJ
C90780 = CAP NP_0: cap,22.00uF,+/-20%,10V,X5R,C0603; Manufacturer: TDK; Voltage: 25V; RK PN: C1608X5R1A226M080AC; Priority: A; C_Voltage: 6.3V; Tolerance: 20%; PCB Footprint: C0805; Dielectric: X5R; Part Type: C0603; Manufacturer PN: C1608X5R1A226M080AC; Created by: JJJ
C90781 = C / 100 / nF / 0201_6: 0201 ∮ 10% 100nf X5R 6.3V; FunctionGroup: Petrus / BB; FPLIST: C0201,M0201; Property1: ∮ 10%; FS: Y; PCB Footprint: C0805; Property2: X5R; Property3: 6.3V
D41 = DIODE ZENER1_0: ZENER DIODE,Vz=3.3V,BZT52C3V3,SOD-123; Manufacturer: 长电; Priority: A; PCB Footprint: SOD_123; RK PN: BZT52C3V3; Part Type: Zener Diodes; Manufacturer PN: BZT52C3V3; Created by: JJJ
ESD2701 = DIODE BI_DIR TRIG_1_Dup1: as D90032 on sheet 13_USB30_USB20; PCB Footprint: ESD0402; Created by: JJJ; Part Type: ESD_TVS; RK PN: ESD5341N
ESD2702-ESD2704 ESD2706 ESD27052 = DIODE BI_DIR TRIG_1_Dup1: as D90035 on sheet 13_USB30_USB20; PCB Footprint: ESD0402; Part Type: ESD_TVS; Manufacturer PN: ESD5341N; Created by: JJJ
J8202 = USB31_TYPE_C: USB Type-C 连接座; Manufacturer: 泰科; Priority: A; PCB Footprint: TYPEC-24PIN-SMD-OK; RK PN: USB_TYPEC_115H0; Part Type: USB Jack; Manufacturer Part Number: USB_TYPEC_115H0; Created by: JJJ
L90020 = MCZ1210AH900L2_1_Dup1: PCB Footprint: MCZ1210AH900L2
R2004 = RESISTOR_1: 通用厚膜电阻,100K,+/-5%,R0201,1/20W.; Manufacturer: YAGEO; Tolerance: 5%; RK PN: RC0201JR-07100KL; Priority: A; Wattage: 1/20W; PCB Footprint: R0201; Part Type: 通用厚膜电阻; Manufacturer PN: RC0201JR-07100KL; Created by: YTL
R2005 = RESISTOR_1: 通用厚膜电阻,2M,+/-5%,R0201,1/20W.; Manufacturer PN: RC0201JR-072ML; Manufacturer: YAGEO; Tolerance: 5%; OPTION: DNP; Wattage: 1/20W; Priority: A; PCB Footprint: R0201; Created by: YTL; Part Type: 通用厚膜电阻; RK PN: RC0201JR-072ML
R2006 = RESISTOR_1: 通用厚膜电阻,2M,+/-5%,R0201,1/20W.; Manufacturer: YAGEO; Tolerance: 5%; OPTION: DNP; RK PN: RC0201JR-072ML; Priority: A; Wattage: 1/20W; PCB Footprint: R0201; Part Type: 通用厚膜电阻; Manufacturer PN: RC0201JR-072ML; Created by: YTL
R2007 = RESISTOR_1: 通用厚膜电阻,100K,+/-5%,R0201,1/20W.; Manufacturer PN: RC0201JR-07100KL; Manufacturer: YAGEO; Tolerance: 5%; Wattage: 1/20W; Priority: A; PCB Footprint: R0201; Created by: YTL; Part Type: 通用厚膜电阻; RK PN: RC0201JR-07100KL
R2013 R2015 R2016 = RESISTOR_1: 通用厚膜电阻,0R,+/-5%,R0201,1/20W.; Manufacturer PN: RC0201JR-070RL; Manufacturer: YAGEO; Tolerance: 5%; Wattage: 1/20W; Priority: A; PCB Footprint: R0201; Created by: YTL; Part Type: 通用厚膜电阻; RK PN: RC0201JR-070RL
R2017 = RESISTOR_1: 通用厚膜电阻,0R,+/-5%,R0201,1/20W.; Manufacturer: YAGEO; Tolerance: 5%; RK PN: RC0201JR-070RL; Priority: A; Wattage: 1/20W; PCB Footprint: R0201; Part Type: 通用厚膜电阻; Manufacturer PN: RC0201JR-070RL; Created by: YTL
R2611 = RESISTOR_1: 通用厚膜电阻,100K,+/-5%,R0402,1/16W.; Manufacturer: YAGEO; Tolerance: 5%; RK PN: RC0402JR-07100KL; Priority: A; Wattage: 1/16W; PCB Footprint: R0402; Part Type: 通用厚膜电阻; Manufacturer PN: RC0402JR-07100KL; Created by: YTL
R2612 = RESISTOR_1: 通用厚膜电阻,4K7,+/-5%,R0402,1/16W.; Manufacturer: YAGEO; Tolerance: 5%; RK PN: RC0402JR-074K7L; Priority: A; Wattage: 1/16W; PCB Footprint: R0402; Part Type: 通用厚膜电阻; Manufacturer PN: RC0402JR-074K7L; Created by: YTL
R2613 = RESISTOR_1: as R95374 on sheet 14_FAN_RTC; PCB Footprint: R0402; Part Type: 通用厚膜电阻; Manufacturer PN: RC0402JR-0710KL; Created by: YTL
R91188 = RESISTOR_0_Dup1: as R95550 on sheet 13_USB30_USB20; PCB Footprint: R0402; Created by: YTL; Part Type: 通用厚膜电阻; RK PN: RC0402JR-072R2L
R91189 R95546 R95547 = RESISTOR_0_Dup1: as R95551 on sheet 13_USB30_USB20; PCB Footprint: R0402; Part Type: 通用厚膜电阻; Manufacturer PN: RC0402JR-072R2L; Created by: YTL
R95599 = RESISTOR_1: as R95028 on sheet 14_FAN_RTC; PCB Footprint: R0402; Created by: YTL; Part Type: 通用厚膜电阻; RK PN: RC0402JR-0710KL
U2602 = USB_FUSB302B: Programmable USB Type-C Controller w/PD; Manufacturer: Fairchild(飞兆半导体); Priority: A; PCB Footprint: MLP14_2R50X2R50X0R80; RK PN: FUSB302BMPX; Part Type: USB; Manufacturer PN: FUSB302BMPX; Created by: JJJ
U2603 = SWITCH_SY6280: Low Loss Power Distribution Switch; Manufacturer: Silergy（矽力杰）; Priority: A; PCB Footprint: SOT_23_5; RK PN: SY6280AAC; Part Type: Switch; Manufacturer PN: SY6280AAC; Created by: JJJ
U90040 U90127 = ESD_TPD4E05U06: unidirectional ESD protection devices with ultra low capacitance; Manufacturer: TI（德州仪器）; Priority: A; PCB Footprint: SON10_2R50X1R00X0R50; Created by: JJJ; Manufacturer PN: TPD4E05U06; Part Type: ESD_TVS; RK PN: TPD4E05U06
*#18 = radxa_1010: Page Create Date: March  8, 1995; Page Modify Date: *